# Altium schematic sheet medidor_inductancias.SchDoc
size A4; Organization: Altium Limited; Address1: L3, 12a Rodborough Rd; Address2: Frenchs Forest; Address3: NSW; Address4: Australia 2086
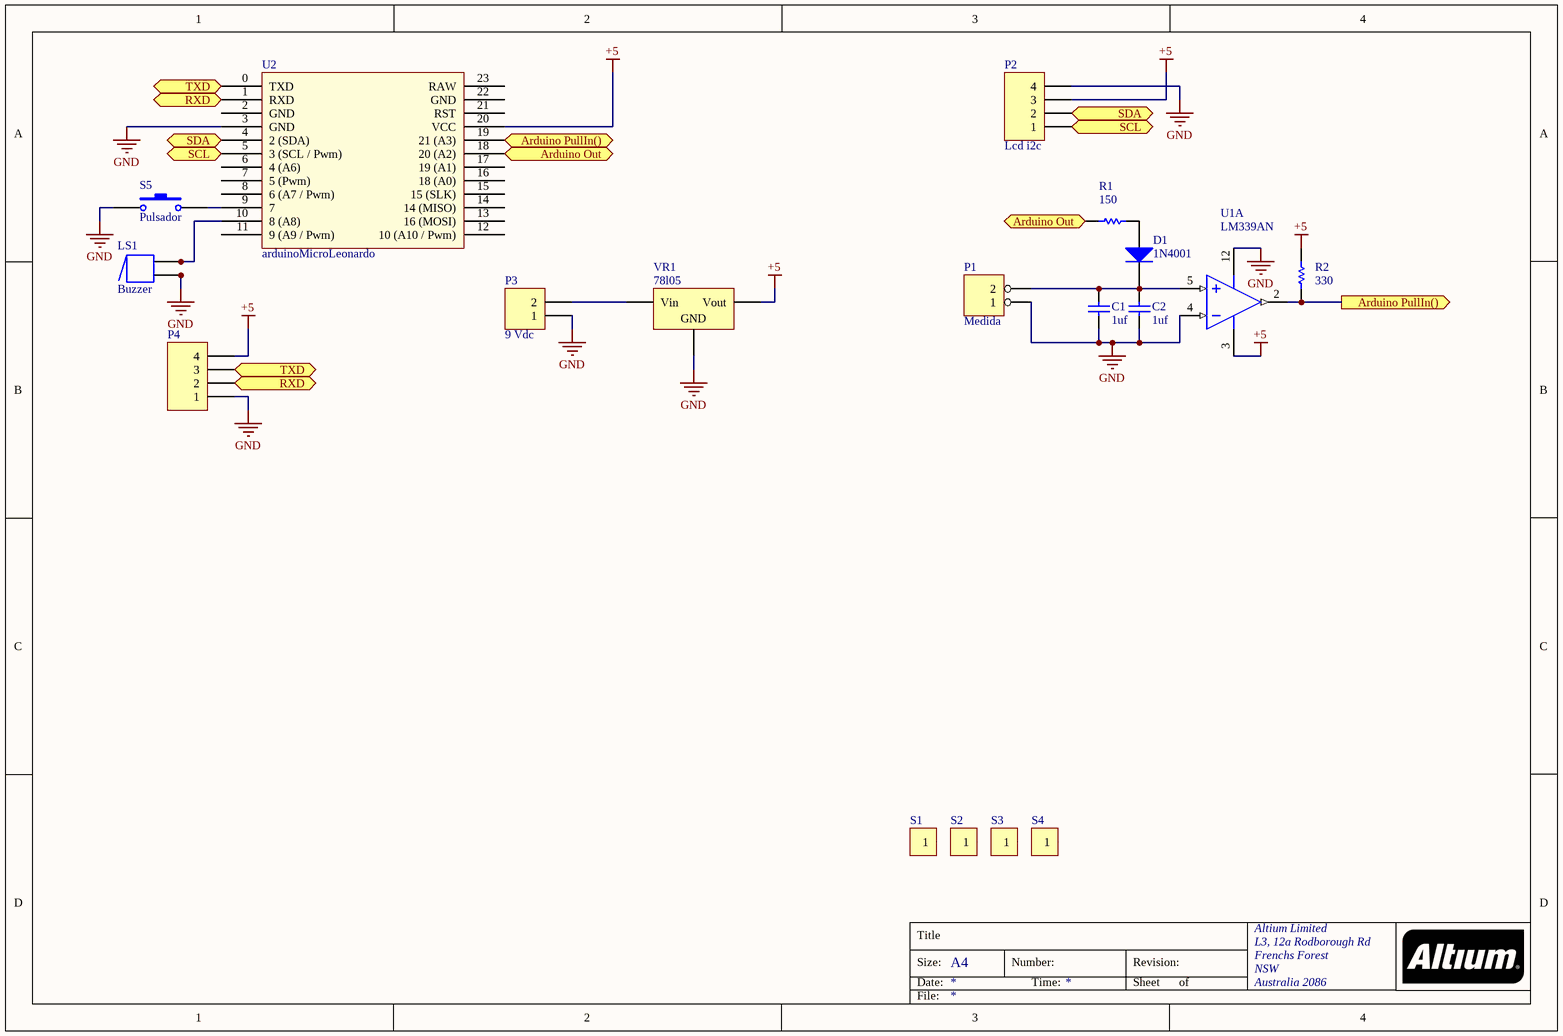
[diagram p0: medidor_inductancias.SchDoc]

## Parts
C1  1uf  [condensador_1uf_10mm]
C2  1uf  [condensador_1uf_10mm]
D1  1N4001  [DO-41]
LS1  Buzzer  [Buzzer]
P1  Medida  [power 2]
P2  Lcd i2c  [HDR1X4]
P3  9 Vdc  [HDR1X2]
P4  Header 4  [HDR1X4]  (value not drawn)
R1  value 150  [150]
R2  value 330  [330]
S1  Separador Hexagonal  [Separador_hex]  (value not drawn)
S2  Separador Hexagonal  [Separador_hex]  (value not drawn)
S3  Separador Hexagonal  [Separador_hex]  (value not drawn)
S4  Separador Hexagonal  [Separador_hex]  (value not drawn)
S5  Pulsador  [pulsador_pie]
U1  LM339AN  [N14A]  (part A of 4)
U2  arduinoMicroLeonardo  [ArduinoMicroLeonardo]
VR1  78l05  [78Lxx]

## Ports
Arduino Out (in), Arduino Out (out), Arduino PullIn() (in), Arduino PullIn() (out), RXD (in), RXD (out), SCL, SDA, TXD (in), TXD (out)

## Nets
+5: P2.3 P4.4 R2.2 U1.3(V+) U2.20(VCC) VR1.3(Vout)
GND: C1.1 C2.1 LS1.2 P1.1 P2.4 P3.1 P4.1 S5.1 U1.4(IN1-) U1.12(GND) U2.3(GND) VR1.2(GND)
Arduino Out: R1.1 U2.18(20_(A2)) ; port Arduino Out
Arduino PullIn(): R2.1 U1.2(OUT1) U2.19(21_(A3)) ; port Arduino PullIn()
RXD: P4.2 U2.1(RXD) ; port RXD
SCL: P2.1 U2.5(3_(SCL_/_Pwm)) ; port SCL
SDA: P2.2 U2.4(2_(SDA)) ; port SDA
TXD: P4.3 U2.0(TXD) ; port TXD
NetC1_2: C1.2 C2.2 D1.2(K) P1.2 U1.5(IN1+)
NetD1_1: D1.1(A) R1.2
NetLS1_1: LS1.1 U2.10(8_(A8))
NetP3_2: P3.2 VR1.1(Vin)
NetS5_2: S5.2 U2.9(7)

Not connected (* = marked no-connect by the designer): S1 1; S2 1; S3 1; S4 1; U2 2(GND) 6(4_(A6)) 7(5_(Pwm)) 8(6_(A7_/_Pwm)) 11(9_(A9_/_Pwm)) 12(10_(A10_/_Pwm)) 13(16_(MOSI)) 14(14_(MISO)) 15(15_(SLK)) 16(18_(A0)) 17(19_(A1)) 21(RST) 22(GND) 23(RAW)

## Notes on the sheet
- Title
- Size:
- Date:
- A4
- Number:
- Time:
- Revision:
- Sheet
- of
- File:

## Library data of the parts
C1 = Cap: Capacitor; Published: 8-Jun-2000; LatestRevisionDate: 17-Jul-2002; LatestRevisionNote: Re-released for DXP Platform.; PackageReference: RAD-0.3; Publisher: Altium Limited; Value: 1uf
C2 = Cap: Capacitor; Value: 100pF; Published: 8-Jun-2000; LatestRevisionDate: 17-Jul-2002; LatestRevisionNote: Re-released for DXP Platform.; PackageReference: RAD-0.3; Publisher: Altium Limited
D1 = Diode 1N4001: 1 Amp General Purpose Rectifier; Published: 8-Jun-2000; LatestRevisionDate: 17-Jul-2002; LatestRevisionNote: Re-released for DXP Platform.; DatasheetDocument: 1998; PackageDocument: Aug-1999; PackageReference: DO-41; Publisher: Altium Limited; Code_JEDEC: DO-204-AL; ComponentLink1Description: Manufacturer Link; ComponentLink1URL: http://www.fairchildsemi.com/; ComponentLink2Description: Datasheet; ComponentLink2URL: http://www.fairchildsemi.com/ds/1N%2F1N4001.pdf
LS1 = Buzzer: Magnetic Transducer Buzzer; Published: 24-Mar-1999; LatestRevisionDate: 17-Dec-2003; LatestRevisionNote: Schematic revised, PCB Footprint replaced.; DatasheetDocument: 17-Dec-2003; PackageReference: ABSM-1574; Publisher: Altium Limited; ComponentLink1Description: Manufacturer Link; ComponentLink1URL: http://www.megastar.com/linecard/buzzmode/index.php
P1 = Borna 2: Header, 2-Pin; LatestRevisionDate: 17-Jul-2002; LatestRevisionNote: Re-released for DXP Platform.; Publisher: Altium Limited
P2 = Header 4: Lcd; LatestRevisionDate: 17-Jul-2002; LatestRevisionNote: Re-released for DXP Platform.; Publisher: Altium Limited
P3 = Header 2: LatestRevisionDate: 17-Jul-2002; LatestRevisionNote: Re-released for DXP Platform.; Publisher: Altium Limited
P4 = Header 4: Header, 4-Pin; LatestRevisionDate: 17-Jul-2002; LatestRevisionNote: Re-released for DXP Platform.; Publisher: Altium Limited
R1 = 150: Resistor; Published: 8-Jun-2000; LatestRevisionDate: 17-Jul-2002; LatestRevisionNote: Re-released for DXP Platform.; PackageReference: AXIAL-0.3; Publisher: Altium Limited
R2 = 330: Resistor; Published: 8-Jun-2000; LatestRevisionDate: 17-Jul-2002; LatestRevisionNote: Re-released for DXP Platform.; PackageReference: AXIAL-0.3; Publisher: Altium Limited
S5 = Pulsador: Pulsador circuito impreso 14x12; Published: 24-Mar-1999; LatestRevisionDate: 17-Jul-2002; LatestRevisionNote: Re-released for DXP Platform.; PackageReference: SPST-2; Publisher: Altium Limited
U1 = LM339AN: Low Power Low Offset Voltage Quad Comparator, 14-pin MDIP; Manufacturer: National Semiconductor; PackageTopMarking: NSUZXYYTTE#*LM339AN; PowerWise: N; CompType: Amplifiers; Published: 4-Dec-2008; DatasheetVersion: Mar-2004; PackageVersion: revG, May-2006; PackageReference: N14A; Publisher: Altium Limited; PackageDescription: MDIP, .750 x .250 x.130in, 14 Lead, .100in Pitch; Supplier 1: Farnell; Supplier Part Number 1: 9487646; PartNumber: LM339AN; RoHS: N; PinCount: 14; Code_JEDEC: MS-001-AA; ComponentLink1Description: LM339 Datasheet; ComponentLink1URL: http://www.national.com/ds/LM/LM339.pdf; ComponentLink2Description: LM339 Web Page; ComponentLink2URL: http://www.national.com/pf/LM/LM339.html; ComponentLink3Description: N14A Package Page; ComponentLink3URL: http://www.national.com/packaging/folders/n14a.html
VR1 = Volt Reg: Voltage Regulator; Published: 24-Mar-1999; LatestRevisionDate: 17-Jul-2002; LatestRevisionNote: Re-released for DXP Platform.; PackageReference: D2PAK; Publisher: Altium Limited; Code_JEDEC: SMD-220